# EAGLE schematic THAPMU _2.0 (EAGLE 9.6.2)
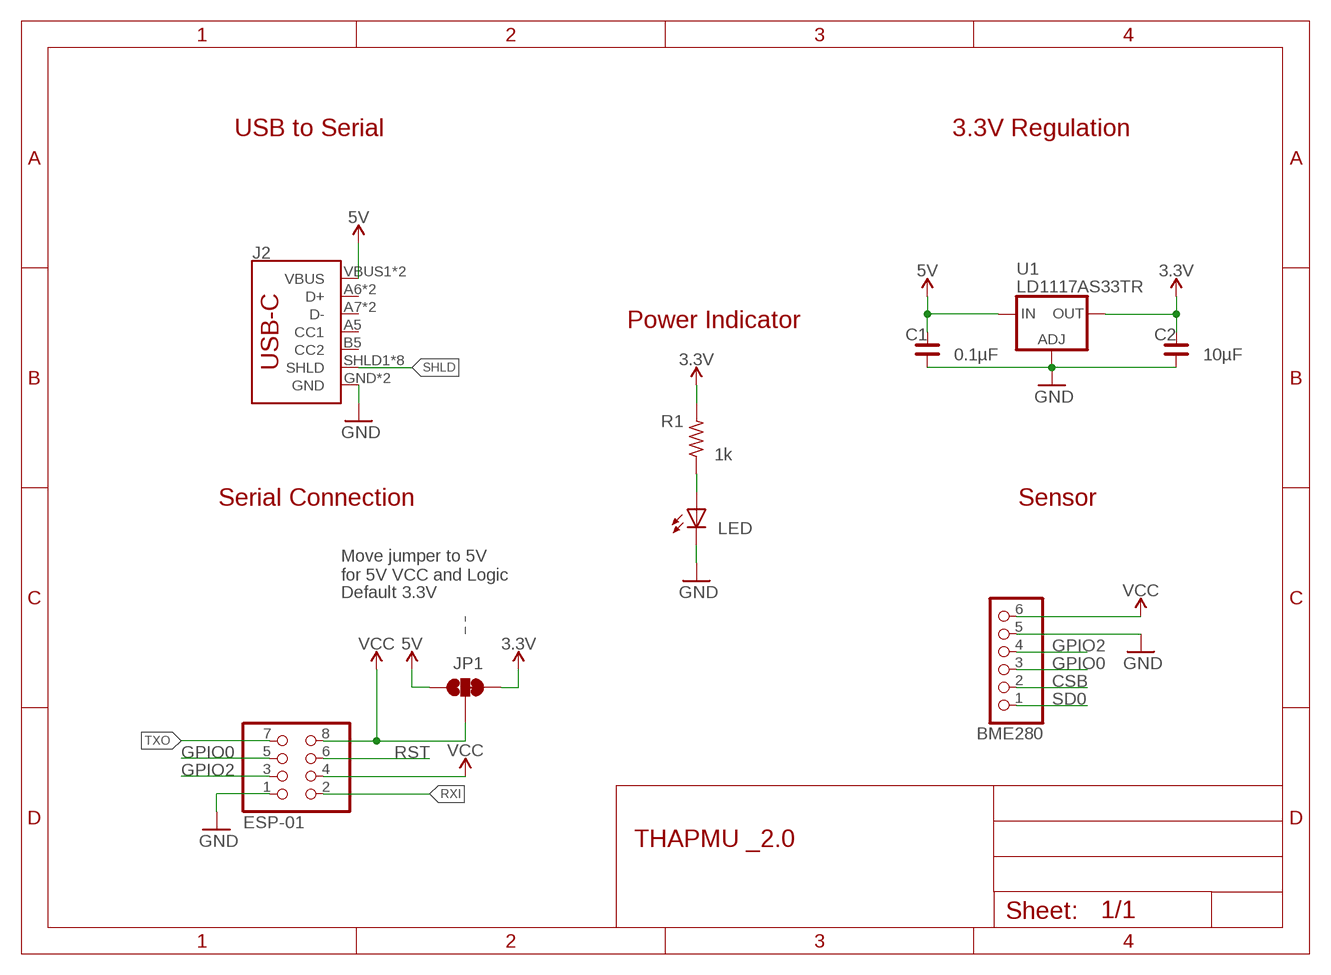
[diagram p0: schematic, sheet 1]

## Parts
BME280  PINHD-1X6  [1X06]
C1  0.1µF  C1206  [C1206]
C2  10µF  C1206  [C1206]
ESP-01  PINHD-2X4  [2X04]
J2  USB_C16PIN  [USB-C-16P]
JP1  JUMPER-SMT_3_1-NC_TRACE_SILK  [SMT-JUMPER_3_1-NC_TRACE_SILK]
LED  LEDSMT1206  [1206]
R1  1k  R1206  [R1206]
U1  LD1117AS33TR  LD117AS33TR  [SOT223]

## Nets
3.3V [power]: C2.2 JP1.3 R1.2 U1.4(OUT)
5V: C1.2 J2.VBUS1(VBUS) J2.VBUS2(VBUS) JP1.1 U1.3(IN)
CSB: BME280.2
GND [power]: BME280.5 C1.1 C2.1 ESP-01.1 J2.GND J2.GND2(GND) LED.C U1.1(ADJ)
GPIO0: BME280.3 ESP-01.5
GPIO2: BME280.4 ESP-01.3
N$2: LED.A R1.1
RST: ESP-01.6
RXI: ESP-01.2
SD0: BME280.1
SHLD: J2.SHLD1(SHLD) J2.SHLD2(SHLD) J2.SHLD3(SHLD) J2.SHLD4(SHLD) J2.SHLD5(SHLD) J2.SHLD6(SHLD) J2.SHLD7(SHLD) J2.SHLD8(SHLD)
TXO: ESP-01.7
VCC: BME280.6 ESP-01.4 ESP-01.8 JP1.2
Unconnected: J2.A5(CC1) J2.A6(D+) J2.A7(D-) J2.B5(CC2) J2.B6(D+) J2.B7(D-)

## Notes on the sheet
- USB to Serial | 3.3V Regulation
- Power Indicator
- Serial Connection | Sensor
- Move jumper to 5V
  for 5V VCC and Logic
- Default 3.3V

## Library data of the parts
BME280 = pinhead:PINHD-1X6: PIN HEADER
C1 C2 = TheLibrary:C1206
ESP-01 = pinhead:PINHD-2X4: PIN HEADER
J2 = SparkFun-Connectors:USB_C: USB Type C 16Pin Connector Super Speed pins not available on the 16-pin purely SMD connector so this part is best for USB 2.0 implementations. D1 and D2 are tied together enabling D+/- no matter which way the cable is plugged into the connector. The two channel configuration pins (CC1/2) are exposed. These are normally connected to ground via 5.1k resistors but can be reconfigured for high current/high power applications.; PROD_ID: CONN-14122
JP1 = SparkFun-Jumpers:JUMPER-SMT_3_1-NC_TRACE: Normally closed trace jumper (1 of 2 connections) This jumper has a trace between two pads so it's normally closed (NC). The other connection is normally open (NO). Use a razor knife to open the connection. For best results follow the IPC guidelines for cutting traces: Cutout at least 0.063 mm (0.005 in). Remove all loose material to clean up the cut area. Seal the cut with an approved epoxy. Reapply solder to reclose the connection, or to close the NO connection.
LED = led:LED: LED OSRAM: - CHIPLED LG R971, LG N971, LY N971, LG Q971, LY Q971, LO R971, LY R971 LH N974, LH R974 LS Q976, LO Q976, LY Q976 LO Q996 - Hyper CHIPLED LW Q18S LB Q993, LB Q99A, LB R99A - SideLED LS A670, LO A670, LY A670, LG A670, LP A670 LB A673, LV A673, LT A673, LW A673 LH A674 LY A675 LS A676, LA A676, LO A676, LY A676, LW A676 LS A679, LY A679, LG A679 - Hyper Micro SIDELED® LS Y876, LA Y876, LO Y876, LY Y876 LT Y87S - SmartLED LW L88C, LW L88S LB L89C, LB L89S, LG L890 LS L89K, LO L89K, LY L89K LS L896, LA L896, LO L896, LY L896 - TOPLED LS T670, LO T670, LY T670, LG T670, LP T670 LSG T670, LSP T670, LSY T670, LOP T670, LYG T670 LG T671, LOG T671, LSG T671 LB T673, LV T673, LT T673, LW T673 LH T674 LS T676, LA T676, LO T676, LY T676, LB T676, LH T676, LSB T676, LW T676 LB T67C, LV T67C, LT T67C, LS T67K, LO T67K, LY T67K, LW E67C LS E67B, LA E67B, LO E67B, LY E67B, LB E67C, LV E67C, LT E67C LW T67C LS T679, LY T679, LG T679 LS T770, LO T770, LY T770, LG T770, LP T770 LB T773, LV T773, LT T773, LW T773 LH T774 LS E675, LA E675, LY E675, LS T675 LS T776, LA T776, LO T776, LY T776, LB T776 LHGB T686 LT T68C, LB T68C - Hyper Mini TOPLED® LB M676 - Mini TOPLED Santana® LG M470 LS M47K, LO M47K, LY M47K Source: http://www.osram.convergy.de/
R1 = TheLibrary:R1206
U1 = v-reg:LD117A?*: Low drop fixed and adjustable positive voltage regulators 1 A Source: http://www.st.com/stonline/products/literature/ds/7194/ld1117axx.pdf

## Net classes
1 power: width 0.178 mm